# Altium schematic sheet FMB-POWER.SchDoc
size A4
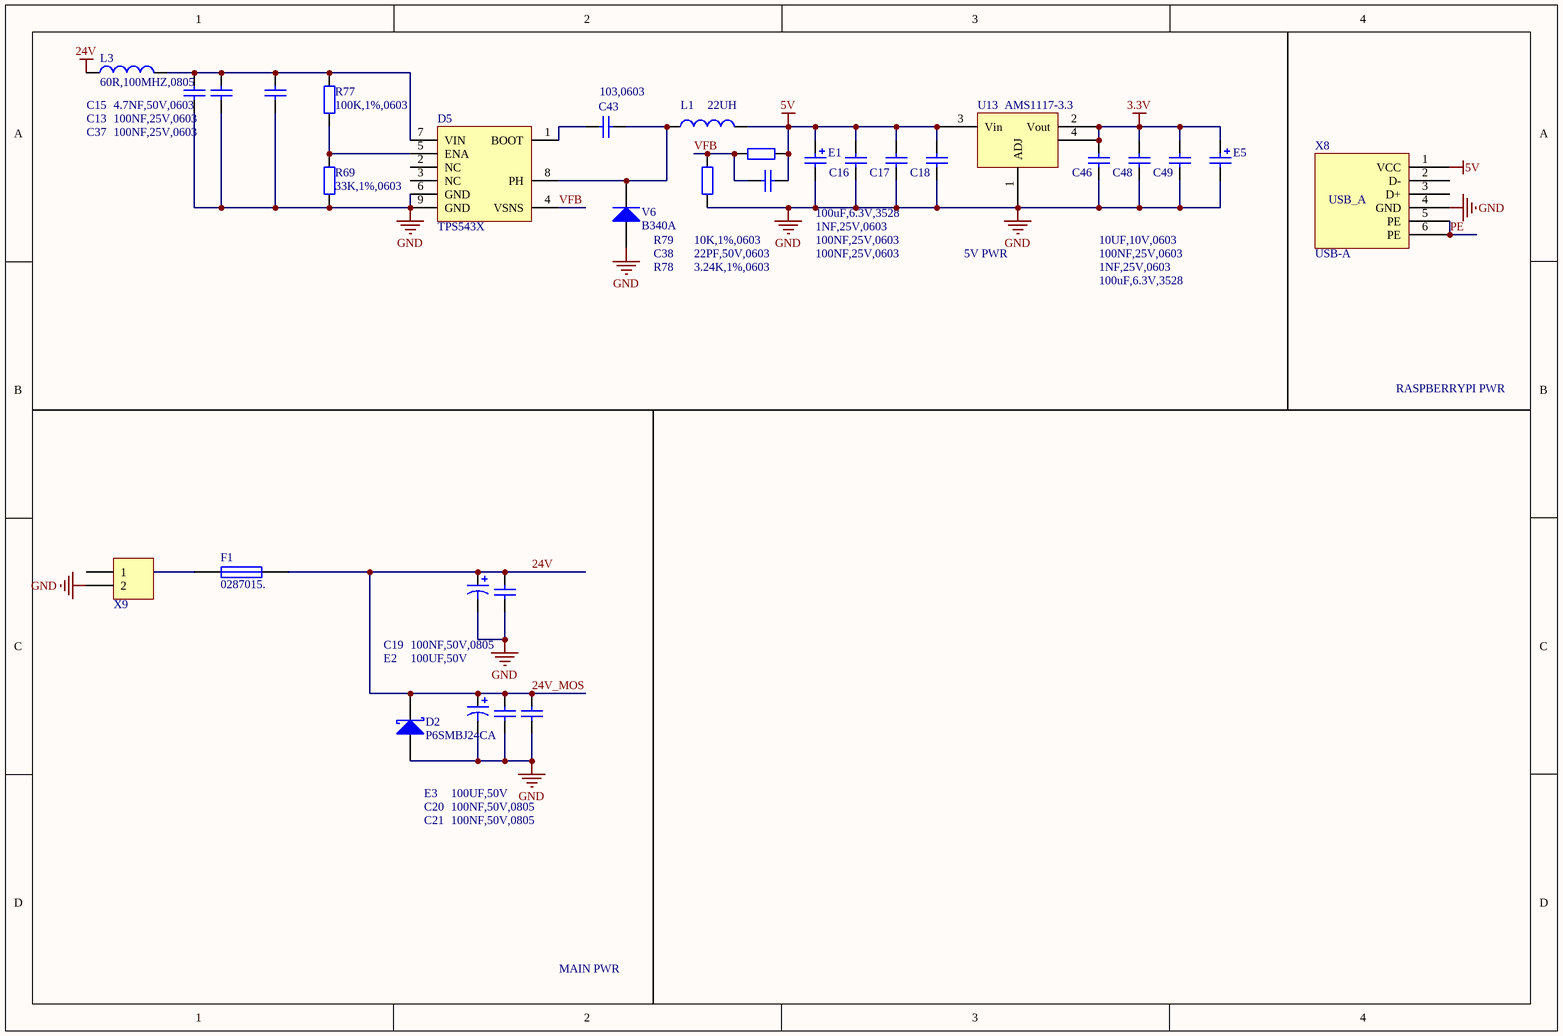
[diagram p0: FMB-POWER.SchDoc]

## Parts
C13  100NF,25V,0603  [RC0603]
C15  4.7NF,50V,0603  [RC0603]
C16  1NF,25V,0603  [RC0603]
C17  100NF,25V,0603  [RC0603]
C18  100NF,25V,0603  [RC0603]
C19  100NF,50V,0805  [RC0805]
C20  100NF,50V,0805  [RC0805]
C21  100NF,50V,0805  [RC0805]
C37  100NF,25V,0603  [RC0603]
C38  22PF,50V,0603  [RC0603]
C43  103,0603  [RC0603]
C46  100NF,25V,0603  [RC0603]
C48  10UF,10V,0603  [RC0603]
C49  1NF,25V,0603  [RC0603]
D2  P6SMBJ24CA  [SMB]
D5  TPS543X  [SO-8-1]
E1  100uF,6.3V,3528  [3528-21]
E2  100UF,50V  [RB-.2X.4]
E3  100UF,50V  [RB-.2X.4]
E5  value 100uF,6.3V,3528
F1  0287015.  [GF-C40]
L1  22UH  [L7*7]
L3  60R,100MHZ,0805  [RC0805]
R69  33K,1%,0603  [RC0603]
R77  100K,1%,0603  [RC0603]
R78  3.24K,1%,0603  [RC0603]
R79  10K,1%,0603  [RC0603]
U13  AMS1117-3.3  [SOT-223]
V6  B340A  [SMA]
X8  USB-A  [USB-A180]
X9  Molex 151048-1206  [151048]  (value not drawn)

## Nets
3.3V: C46.2 C48.2 C49.2 E5.1 U13.2(Vout) U13.4
5V: C16.2 C17.2 C18.2 C38.1 E1.1 L1.2 R79.2 U13.3(Vin) X8.1(VCC)
24V: C19.1 C20.1 C21.1 D2.2(K) E2.1 E3.1 F1.1 L3.1  [also labelled 24V_MOS]
GND: C13.2 C15.1 C16.1 C17.1 C18.1 C19.2 C20.2 C21.2 C37.2 C46.1 C48.1 C49.1 D2.1(A) D5.6(GND) D5.9(GND) E1.2 E2.2 E3.2 E5.2 R69.2 R78.2 U13.1(ADJ) V6.1(A) X8.4(GND) X9.2
PE: X8.5(PE) X8.6(PE)
VFB: C38.2 D5.4(VSNS) R78.1 R79.1
NetC13_1: C13.1 C15.2 C37.1 D5.7(VIN) L3.2 R77.1
NetC43_1: C43.1 D5.8(PH) L1.1 V6.2(K)
NetC43_2: C43.2 D5.1(BOOT)
NetD5_5: D5.5(ENA) R69.1 R77.2
NetF1_2: F1.2 X9.1

Not connected (* = marked no-connect by the designer): D5 2(NC) 3(NC); X8 2(D-) 3(D+)

## Notes on the sheet
- 5V PWR
- RASPBERRYPI PWR
- MAIN PWR
- (in symbol USB-A) USB_A

## Library data of the parts
C13 C15-C21 C37 C38 C43 C46 C48 C49 = Cap: Capacitor; Value: 100pF; Published: 8-Jun-2000; LatestRevisionDate: 17-Jul-2002; LatestRevisionNote: Re-released for DXP Platform.; PackageReference: RAD-0.3; Publisher: Altium Limited; PackageDescription: Radial Cap, Thru-Hole; 2 Leads; 0.3 in Pin Spacing
D2 = D Schottky: Schottky Diode; Published: 8-Jun-2000; LatestRevisionDate: 17-Jul-2002; LatestRevisionNote: Re-released for DXP Platform.; PackageReference: SMB; Publisher: Altium Limited; PackageDescription: DO-214-AA/SMB; 2 C-Bend Leads; Body 5.3 x 3.6 mm, inc. leads (LxW); Code_JEDEC: DO-214-AA
E1 E5 = Cap Pol2: Polarized Capacitor (Axial); Published: 8-Jun-2000; LatestRevisionDate: 17-Jul-2002; LatestRevisionNote: Re-released for DXP Platform.; PackageReference: POLAR0.8; Publisher: Altium Limited; PackageDescription: Polarized Capacitor; 2 Leads
  E1: Value: 100uF,6.3V,3528
E2 E3 = Cap Pol3: Polarized Capacitor (Surface Mount); Value: 100pF; Published: 8-Jun-2000; LatestRevisionDate: 29-May-2009; LatestRevisionNote: IPC-7351 Footprint Added.; PackageReference: C0805; Publisher: Altium Limited; PackageDescription: Chip Capacitor
F1 = Fuse 1: Fuse; Published: 8-Jun-2000; LatestRevisionDate: 17-Jul-2002; LatestRevisionNote: Re-released for DXP Platform.; PackageReference: PIN-W2/E2.8; Publisher: Altium Limited; PackageDescription: Thru-Hole; 2 Leads
L1 L3 = Inductor: Code_IEC: 1005; Value: 10mH; Published: 8-Jun-2000; LatestRevisionDate: 29-May-2009; LatestRevisionNote: IPC-7351 Footprint Added.; PackageReference: 0402-A; Publisher: Altium Limited; PackageDescription: Chip Inductor; Code_JEITA: 0402
R69 R77-R79 = Res2: Resistor; Value: 1K; Published: 8-Jun-2000; LatestRevisionDate: 17-Jul-2002; LatestRevisionNote: Re-released for DXP Platform.; PackageReference: AXIAL-0.4; Publisher: Altium Limited; PackageDescription: Axial Device, Thru-Hole; 2 Leads; 0.4 in Pin Spacing
V6 = Diode: Default Diode; Published: 8-Jun-2000; LatestRevisionDate: 17-Jul-2002; LatestRevisionNote: Re-released for DXP Platform.; PackageVersion: Sep-1996; PackageReference: SMC; Publisher: Altium Limited; PackageDescription: DO-214-AB/SMC; 2 C-Bend Leads; Body 7.9 x 5.9 mm, inc. leads (LxW); Code_JEDEC: DO-214-AB
X9 = Header 2: Header, 2-Pin; LatestRevisionDate: 17-Jul-2002; LatestRevisionNote: Re-released for DXP Platform.; Publisher: Altium Limited